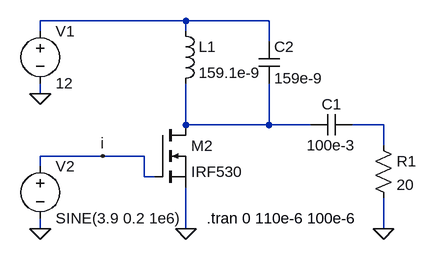
[diagram p0: schematic claseA_MOSFET.asc]
claseA_MOSFET.asc, the LTspice schematic file:
Version 4
SHEET 1 880 680
WIRE 112 -64 -112 -64
WIRE 240 -64 112 -64
WIRE -112 -48 -112 -64
WIRE 112 -48 112 -64
WIRE 240 -32 240 -64
WIRE -112 48 -112 32
WIRE 112 96 112 32
WIRE 240 96 240 32
WIRE 240 96 112 96
WIRE 304 96 240 96
WIRE 416 96 368 96
WIRE 416 128 416 96
WIRE -16 144 -112 144
WIRE 48 144 -16 144
WIRE -112 160 -112 144
WIRE 48 176 48 144
WIRE 64 176 48 176
WIRE -112 256 -112 240
WIRE 112 256 112 192
WIRE 416 256 416 208
FLAG 112 256 0
FLAG -112 256 0
FLAG -112 48 0
FLAG -16 144 i
FLAG 416 256 0
SYMBOL voltage -112 -64 R0
SYMATTR InstName V1
SYMATTR Value 12
SYMBOL res 400 112 R0
SYMATTR InstName R1
SYMATTR Value 20
SYMBOL cap 368 80 R90
WINDOW 0 0 32 VBottom 2
WINDOW 3 32 32 VTop 2
SYMATTR InstName C1
SYMATTR Value 100e-3
SYMBOL voltage -112 144 R0
WINDOW 123 0 0 Left 2
WINDOW 39 0 0 Left 2
SYMATTR InstName V2
SYMATTR Value SINE(3.9 0.2 1e6)
SYMBOL ind 96 -64 R0
SYMATTR InstName L1
SYMATTR Value 159.1e-9
SYMBOL cap 224 -32 R0
SYMATTR InstName C2
SYMATTR Value 159e-9
SYMBOL nmos 64 96 R0
SYMATTR InstName M2
SYMATTR Value IRF530
TEXT 144 240 Left 2 !.tran 0 110e-6 100e-6

The netlist it stands for:
* claseA_MOSFET.asc
V1 N001 0 12
R1 N003 0 20
C1 N003 N002 100e-3
V2 i 0 SINE(3.9 0.2 1e6)
L1 N001 N002 159.1e-9
C2 N001 N002 159e-9
M2 N002 i 0 0 IRF530
.model NMOS NMOS
.model PMOS PMOS
.lib standard.mos
.tran 0 110e-6 100e-6
.backanno
.end